# EAGLE design Motorcontroller (EAGLE 6.1)
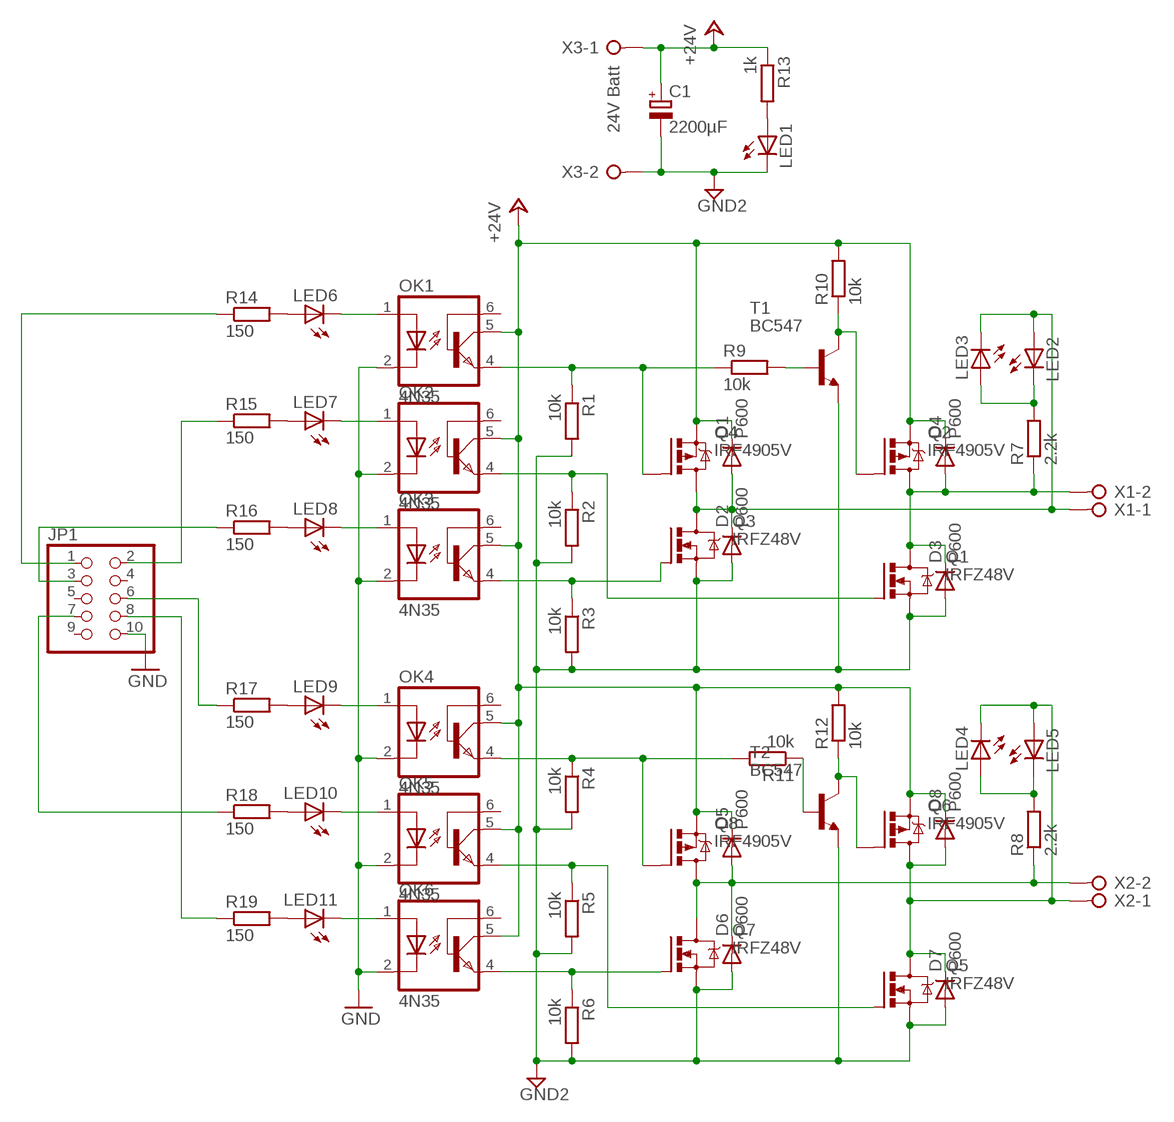
[diagram p0: schematic, sheet 1]

## Parts
C1  2200µF  CPOL-EUE5-13  [E5-13]
D1  P600  [P6-15]
D2  P600  [P6-15]
D3  P600  [P6-15]
D4  P600  [P6-15]
D5  P600  [P6-15]
D6  P600  [P6-15]
D7  P600  [P6-15]
D8  P600  [P6-15]
JP1  PINHD-2X5  [2X05]
LED1  LED3MM  [LED3MM]
LED2  LED3MM  [LED3MM]
LED3  LED3MM  [LED3MM]
LED4  LED3MM  [LED3MM]
LED5  LED3MM  [LED3MM]
LED6  LED3MM  [LED3MM]
LED7  LED3MM  [LED3MM]
LED8  LED3MM  [LED3MM]
LED9  LED3MM  [LED3MM]
LED10  LED3MM  [LED3MM]
LED11  LED3MM  [LED3MM]
OK1  4N35  [DIL06]
OK2  4N35  [DIL06]
OK3  4N35  [DIL06]
OK4  4N35  [DIL06]
OK5  4N35  [DIL06]
OK6  4N35  [DIL06]
Q1  IRFZ48V  [TO220BV]
Q2  IRF4905V  [TO220BV]
Q3  IRFZ48V  [TO220BV]
Q4  IRF4905V  [TO220BV]
Q5  IRFZ48V  [TO220BV]
Q6  IRF4905V  [TO220BV]
Q7  IRFZ48V  [TO220BV]
Q8  IRF4905V  [TO220BV]
R1  10k  R-EU_0207/7  [0207/7]
R2  10k  R-EU_0207/7  [0207/7]
R3  10k  R-EU_0207/10  [0207/10]
R4  10k  R-EU_0207/10  [0207/10]
R5  10k  R-EU_0207/10  [0207/10]
R6  10k  R-EU_0207/10  [0207/10]
R7  2.2k  R-EU_0207/2V  [0207/2V]
R8  2.2k  R-EU_0207/2V  [0207/2V]
R9  10k  R-EU_0207/7  [0207/7]
R10  10k  R-EU_0207/7  [0207/7]
R11  10k  R-EU_0207/10  [0207/10]
R12  10k  R-EU_0207/10  [0207/10]
R13  1k  R-EU_0207/2V  [0207/2V]
R14  150  R-EU_0207/7  [0207/7]
R15  150  R-EU_0207/5V  [0207/5V]
R16  150  R-EU_0207/5V  [0207/5V]
R17  150  R-EU_0207/5V  [0207/5V]
R18  150  R-EU_0207/5V  [0207/5V]
R19  150  R-EU_0207/7  [0207/7]
T1  BC547  [TO92]
T2  BC547  [TO92]
X1  W237-02P  [W237-132]
X2  W237-02P  [W237-132]
X3  24V Batt  W237-02P  [W237-132]

## Nets
+24V: C1.+ D1.C D4.C D5.C D8.C OK1.5(COL) OK2.5(COL) OK3.5(COL) OK4.5(COL) OK5.5(COL) OK6.5(COL) Q2.S Q4.S Q6.S Q8.S R10.2 R12.2 R13.1 X3.1
GND: JP1.10 OK1.2(C) OK2.2(C) OK3.2(C) OK4.2(C) OK5.2(C) OK6.2(C)
GND2: C1.- D2.A D3.A D6.A D7.A LED1.K(C) Q1.S Q3.S Q5.S Q7.S R1.2 R2.2 R3.2 R4.2 R5.2 R6.2 T1.1(E) T2.1(E) X3.2
N$1: D7.C D8.A LED4.K(C) LED5.A Q5.D Q6.D X2.1
N$3: JP1.1 R14.1
N$4: D3.C D4.A Q1.D Q2.D R7.1 X1.2
N$5: JP1.2 R15.1
N$6: LED1.A R13.2
N$7: JP1.3 R16.1
N$8: JP1.6 R17.1
N$9: OK2.4(EMI) Q1.G R2.1
N$10: JP1.7 R18.1
N$11: JP1.8 R19.1
N$12: OK1.4(EMI) Q4.G R1.1 R9.1
N$13: OK3.4(EMI) Q3.G R3.1
N$14: R9.2 T1.2(B)
N$15: Q2.G R10.1 T1.3(C)
N$16: OK4.4(EMI) Q8.G R4.1 R11.2
N$17: LED10.A R18.2
N$18: R11.1 T2.2(B)
N$19: Q6.G R12.1 T2.3(C)
N$20: LED6.A R14.2
N$21: OK5.4(EMI) Q5.G R5.1
N$22: OK6.4(EMI) Q7.G R6.1
N$23: LED2.K(C) LED3.A R7.2
N$24: LED4.A LED5.K(C) R8.2
N$26: LED7.A R15.2
N$27: LED8.A R16.2
N$28: LED9.A R17.2
N$29: LED11.A R19.2
N$30: LED6.K(C) OK1.1(A)
N$31: LED7.K(C) OK2.1(A)
N$32: LED8.K(C) OK3.1(A)
N$33: LED9.K(C) OK4.1(A)
N$34: LED10.K(C) OK5.1(A)
N$35: LED11.K(C) OK6.1(A)
N$36: D1.A D2.C LED2.A LED3.K(C) Q3.D Q4.D X1.1
N$43: D5.A D6.C Q7.D Q8.D R8.1 X2.2
Unconnected: JP1.4 JP1.5 JP1.9 OK1.6(BAS) OK2.6(BAS) OK3.6(BAS) OK4.6(BAS) OK5.6(BAS) OK6.6(BAS)

## Library data of the parts
C1 = rcl:CPOL-EU: POLARIZED CAPACITOR, European symbol
D1-D8 = diode:P600: DIODE high voltage diode, silicon rectifier 1.0 A to 6.0 A, 50 V to 1300 V http://www.kosemi.com/product/diosr.html
JP1 = pinhead:PINHD-2X5: PIN HEADER
LED1-LED11 = led:LED: LED OSRAM: - CHIPLED LG R971, LG N971, LY N971, LG Q971, LY Q971, LO R971, LY R971 LH N974, LH R974 LS Q976, LO Q976, LY Q976 LO Q996 - Hyper CHIPLED LW Q18S LB Q993, LB Q99A, LB R99A - SideLED LS A670, LO A670, LY A670, LG A670, LP A670 LB A673, LV A673, LT A673, LW A673 LH A674 LY A675 LS A676, LA A676, LO A676, LY A676, LW A676 LS A679, LY A679, LG A679 - Hyper Micro SIDELED® LS Y876, LA Y876, LO Y876, LY Y876 LT Y87S - SmartLED LW L88C, LW L88S LB L89C, LB L89S, LG L890 LS L89K, LO L89K, LY L89K LS L896, LA L896, LO L896, LY L896 - TOPLED LS T670, LO T670, LY T670, LG T670, LP T670 LSG T670, LSP T670, LSY T670, LOP T670, LYG T670 LG T671, LOG T671, LSG T671 LB T673, LV T673, LT T673, LW T673 LH T674 LS T676, LA T676, LO T676, LY T676, LB T676, LH T676, LSB T676, LW T676 LB T67C, LV T67C, LT T67C, LS T67K, LO T67K, LY T67K, LW E67C LS E67B, LA E67B, LO E67B, LY E67B, LB E67C, LV E67C, LT E67C LW T67C LS T679, LY T679, LG T679 LS T770, LO T770, LY T770, LG T770, LP T770 LB T773, LV T773, LT T773, LW T773 LH T774 LS E675, LA E675, LY E675, LS T675 LS T776, LA T776, LO T776, LY T776, LB T776 LHGB T686 LT T68C, LB T68C - Hyper Mini TOPLED® LB M676 - Mini TOPLED Santana® LG M470 LS M47K, LO M47K, LY M47K Source: http://www.osram.convergy.de LUXEON: - LUMILED® LXK2-PW12-R00, LXK2-PW12-S00, LXK2-PW14-U00, LXK2-PW14-V00 LXK2-PM12-R00, LXK2-PM12-S00, LXK2-PM14-U00 LXK2-PE12-Q00, LXK2-PE12-R00, LXK2-PE12-S00, LXK2-PE14-T00, LXK2-PE14-U00 LXK2-PB12-K00, LXK2-PB12-L00, LXK2-PB12-M00, LXK2-PB14-N00, LXK2-PB14-P00, LXK2-PB14-Q00 LXK2-PR12-L00, LXK2-PR12-M00, LXK2-PR14-Q00, LXK2-PR14-R00 LXK2-PD12-Q00, LXK2-PD12-R00, LXK2-PD12-S00 LXK2-PH12-R00, LXK2-PH12-S00 LXK2-PL12-P00, LXK2-PL12-Q00, LXK2-PL12-R00 Source: www.luxeon.com KINGBRIGHT: KA-3528ASYC Source: www.kingbright.com
OK1-OK6 = optocoupler:4N35: MOTOROLA OPTO COUPLER; MF: FAIRCHILD SEMICONDUCTOR; MPN: 4N35; OC_FARNELL: 1328375; OC_NEWARK: 72K9946
Q1 Q3 Q5 Q7 = transistor-power:IRFZ48: N Channel HEXFET® Power MOSFET Logic Level Source: http://www.irf.com/product-info/datasheets/data/irfz48z.pdf
Q2 Q4 Q6 Q8 = transistor-power:IRF4905: P-Channel HEXFET® Power MOSFET RDS(on)= 0.02 Ohm, ID = -74A Source: http://www.irf.com/product-info/datasheets/data/irf4905pbf.pdf
R1-R19 = rcl:R-EU_: RESISTOR, European symbol
T1 T2 = transistor:BC547: NPN TRANSISTOR
X1-X3 = con-wago-508:W237-02P: WAGO SREW CLAMP; OC_FARNELL: unknown; OC_NEWARK: unknown

## Board
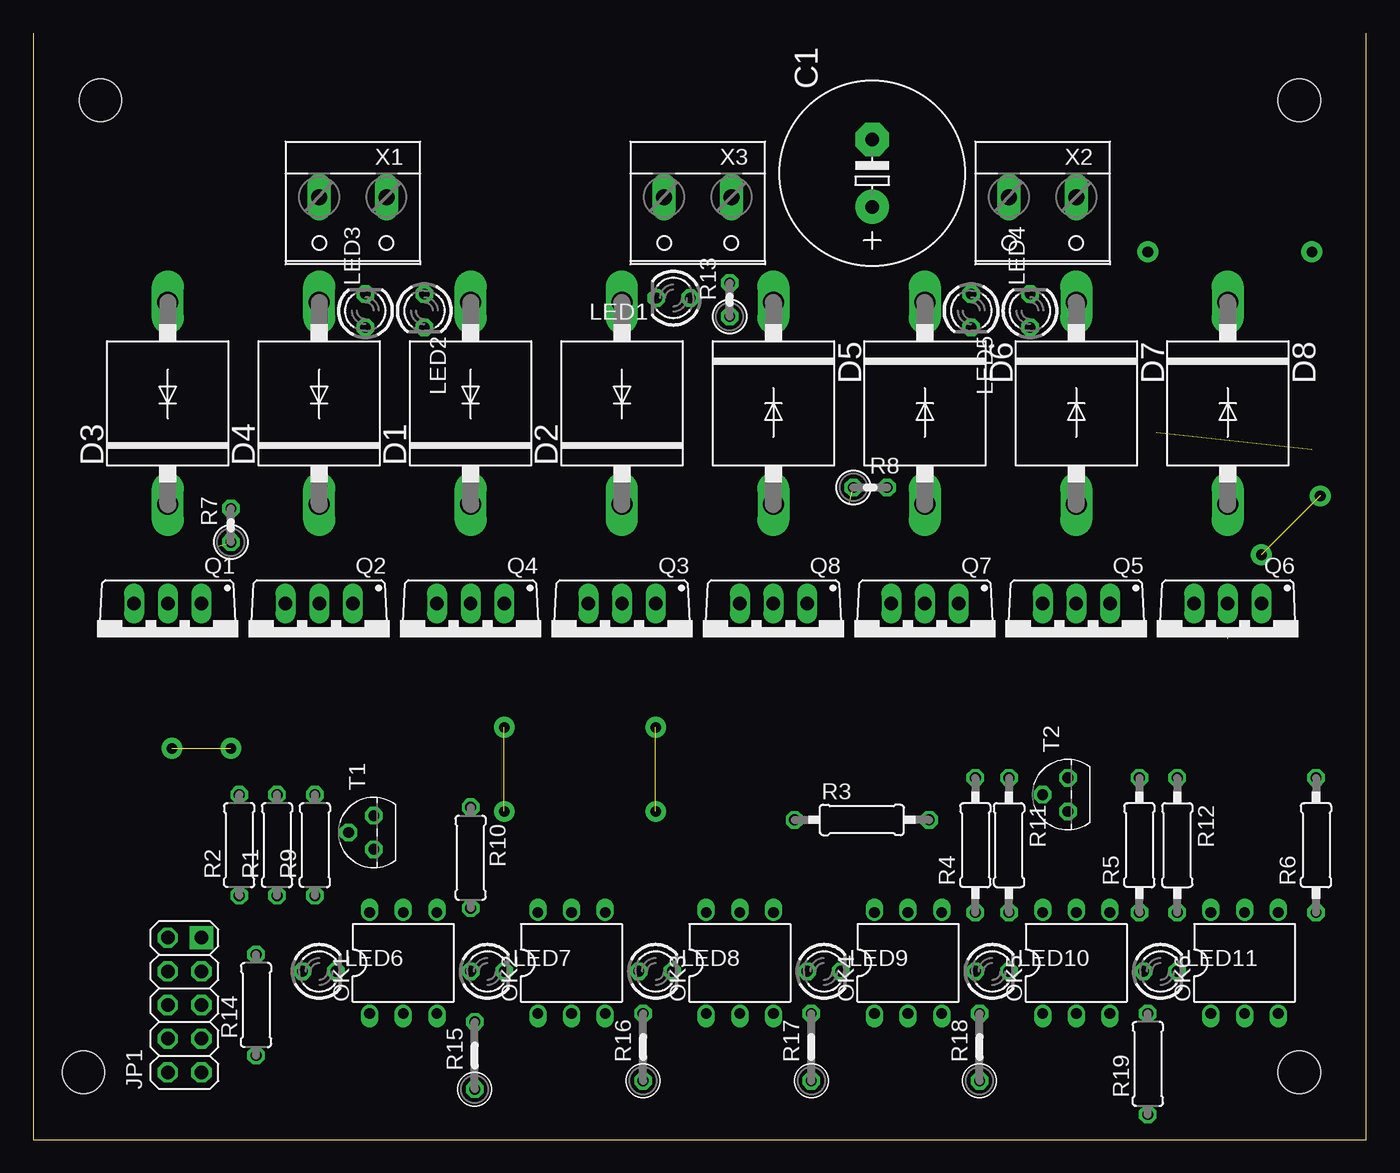
[diagram p1: board, top side]
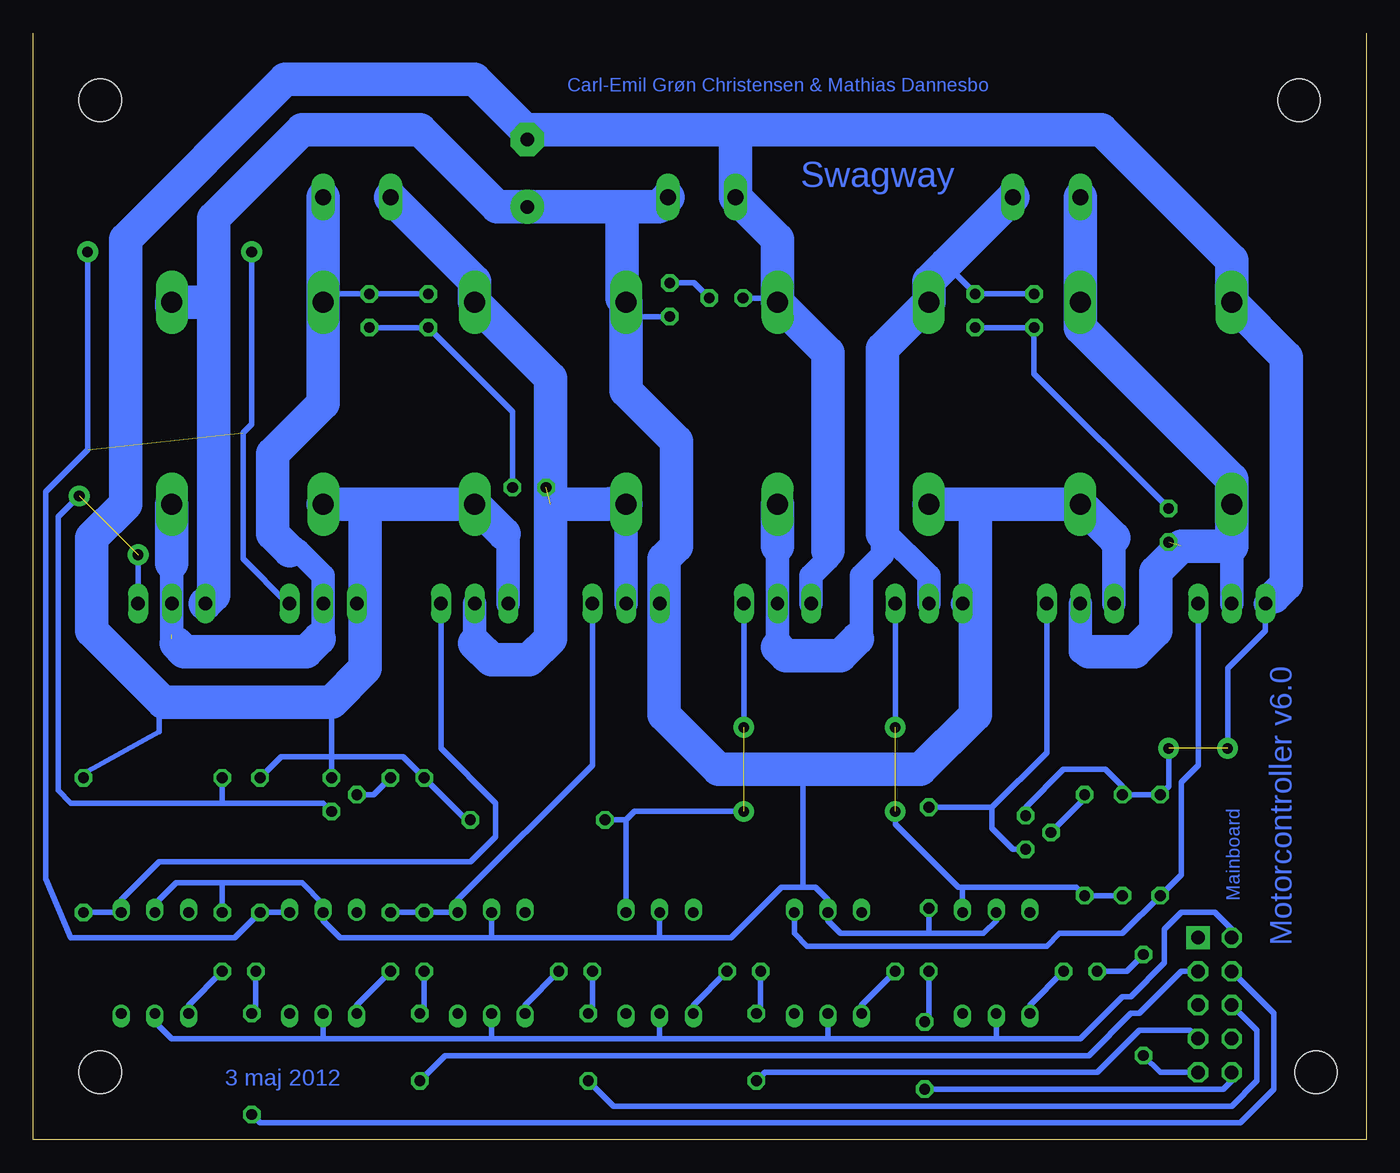
[diagram p2: board, bottom side, seen from below]

Size 100.64 x 83.49 mm. Coordinates in mm from the lower left corner, seen from the top.
Outline: 100.64,83.49 100.64,0 0,0 0,83.49
Copper layers (1*16): Top 0.035mm / dielectric 1.5mm / Bottom 0.035mm
Design rules: minimum track width 10mil, minimum drill 24mil, track to track 8mil, track to pad 8mil, pad to pad 8mil, via to via 8mil, smd to smd 8mil, copper to edge 40mil, drill to drill 8mil, minimum pad ring 10mil, minimum via ring 15mil, stop-mask expansion 4mil, vias tented up to drill 0mil, thermal gap 10mil
Holes 3.2 mm at 5.08,78.42 95.57,78.42 3.81,5.08 95.57,5.08

### Footprints (pad centres in the part's own frame; a part is rotated, then mirrored left to right if it is on the bottom)
E5-13 = drill 1.016 pad 2.54: + -2.54,0 | drill 1.016 pad 2.54 octagon: - 2.54,0
P6-15 = drill 1.6 long: A 7.62,0; C -7.62,0
2X05 = drill 1.016 octagon: 1 -5.08,-1.27; 2 -5.08,1.27; 3 -2.54,-1.27; 4 -2.54,1.27; 5 0,-1.27; 6 0,1.27; 7 2.54,-1.27; 8 2.54,1.27; 9 5.08,-1.27; 10 5.08,1.27
LED3MM = drill 0.813 octagon: A -1.27,0; K 1.27,0
DIL06 = drill 0.813 offset: 1 -2.54,-3.81; 2 0,-3.81; 3 2.54,-3.81; 4 2.54,3.81; 5 0,3.81; 6 -2.54,3.81
TO220BV = drill 1.016 long: D 0,-2.54; G -2.54,-2.54; S 2.54,-2.54
0207/7 = drill 0.813 octagon: 1 -3.81,0; 2 3.81,0
0207/10 = drill 0.813 octagon: 1 -5.08,0; 2 5.08,0
0207/2V = drill 0.813 octagon: 1 -1.27,0; 2 1.27,0
0207/5V = drill 0.813 octagon: 1 -2.54,0; 2 2.54,0
TO92 = drill 0.813 octagon: 1 1.27,0; 2 0,1.905; 3 -1.27,0
W237-132 = drill 1.194 long: 1 -2.54,-0.635; 2 2.54,-0.635

### Placement (x,y rotation side)
C1  63.34,72.93 90 top
D1  33.02,55.56 90 top
D2  44.45,55.56 90 top
D3  10.16,55.56 90 top
D4  21.59,55.56 90 top
D5  55.88,55.56 270 top
D6  67.31,55.56 270 top
D7  78.74,55.56 270 top
D8  90.17,55.56 270 top
JP1  11.43,10.16 90 top
LED1  48.32,63.5 180 top
LED2  29.53,62.55 270 top
LED3  25.08,62.55 90 top
LED4  75.25,62.55 90 top
LED5  70.8,62.55 270 top
LED6  21.59,12.7 0 top
LED7  34.29,12.7 0 top
LED8  46.99,12.7 0 top
LED9  59.69,12.7 0 top
LED10  72.39,12.7 0 top
LED11  85.09,12.7 0 top
OK1  27.94,13.34 0 top
OK2  40.64,13.34 0 top
OK3  53.34,13.34 0 top
OK4  66.04,13.34 0 top
OK5  78.74,13.34 0 top
OK6  91.44,13.34 0 top
Q1  10.16,37.91 180 top
Q2  21.59,37.91 180 top
Q3  44.45,37.91 180 top
Q4  33.02,37.91 180 top
Q5  78.74,37.91 180 top
Q6  90.17,37.91 180 top
Q7  67.31,37.91 180 top
Q8  55.88,37.91 180 top
R1  18.41,22.23 90 top
R2  15.56,22.23 90 top
R3  62.55,24.13 0 top
R4  71.12,22.23 90 top
R5  83.5,22.23 90 top
R6  96.84,22.23 90 top
R7  14.92,46.36 90 top
R8  63.18,49.21 0 top
R9  21.27,22.23 90 top
R10  33.02,21.27 270 top
R11  73.66,22.23 270 top
R12  86.36,22.23 270 top
R13  52.58,63.37 90 top
R14  16.83,10.16 90 top
R15  33.34,6.35 90 top
R16  46.04,6.98 90 top
R17  58.74,6.98 90 top
R18  71.44,6.98 90 top
R19  84.14,5.72 90 top
T1  25.72,23.18 90 top
T2  78.11,26.03 90 top
X1  24.13,70.48 180 top
X2  76.2,70.48 180 top
X3  50.16,70.48 180 top

### Tracks (layer width: path | path; a pad name or v marks a point on that pad's centre or on a via)
+24V
  Bottom 0.406: R13.1 55.75,62.1 | OK1.5 27.94,16.51 28.89,15.56 33.02,15.56 | 33.02,15.56 39.69,15.56 40.64,16.51 OK2.5 40.64,18.1 41.59,19.05 42.55,19.05 | 53.34,15.24 47.94,15.24 44.13,19.05 42.55,19.05 | 53.34,15.24 66.04,15.24 | OK3.5 53.34,15.24 | OK4.5 66.04,15.24 | 66.04,15.24 77.47,15.24 78.74,16.51 OK5.5 78.74,17.78 80.33,19.37 86.36,19.37 | 86.36,19.37 89.85,19.37 91.44,17.78 OK6.5 | R12.2 86.36,19.37 | 42.55,19.05 42.55,27.94 | R10.2 33.02,15.56
  Bottom 1.524: 55.75,62.1 55.88,62.23
  Bottom 1.778: Q2.S 19.05,45.4 | Q8.S 53.15,40.45 53.02,40.32 | Q4.S 29.65,40.45 29.53,40.32
  Bottom 2.54: D1.C 29.53,47.94 | 29.53,47.94 D4.C 19.05,45.4 | 29.53,47.94 29.53,40.32 29.53,32.07 33.66,27.94 42.55,27.94 48.9,27.94 53.02,32.07 53.02,40.32 53.02,43.81 52.07,44.77 52.07,52.7 55.88,56.52 55.88,62.23 D5.C 56.2,63.5 56.2,70.39 | Q6.S 87,41.08 87,63.18 | 87,63.18 87,69.53 80.33,76.2 71.44,76.2 65.62,70.39 C1.+ 56.2,70.39 | 90.17,62.86 D8.C 87,63.18 | X3.1 53.44,70.39 56.2,70.39
GND
  Bottom 0.406: OK1.2 27.94,7.62 | 27.94,7.62 40.64,7.62 | 40.64,7.62 53.34,7.62 | 53.34,7.62 66.04,7.62 | 66.04,7.62 78.74,7.62 | 78.74,7.62 90.17,7.62 91.44,8.89 OK6.2 | OK5.2 78.74,7.62 | OK4.2 66.04,7.62 | OK3.2 53.34,7.62 | OK2.2 40.64,7.62 | JP1.10 10.16,15.88 11.43,17.15 13.97,17.15 15.24,15.88 15.24,13.34 17.78,10.8 18.41,10.8 21.59,7.62 27.94,7.62
GND2  (1 unrouted)
  Bottom 0.406: LED1.K 44.77,63.5 D2.A | T1.1 25.72,25.08 22.86,27.94 19.68,27.94 18.41,26.67 R1.2 R2.2 14.92,26.67 14.92,29.53 | R6.2 96.84,27.62 91.12,30.8 91.12,32.7 90.81,33.02 | Q1.S 7.62,38.42 10.48,35.56 10.48,29.53 | R3.2 67.94,24.13 R4.2 72.71,28.89 78.11,28.89 | 78.11,28.89 81.92,28.89 R5.2 | T2.1 78.11,28.89 | 78.11,28.89 78.11,33.02 | Q5.S 75.69,40.45 75.56,40.32
  Bottom 1.778: Q1.S 7.49,40.45 6.99,40.96 | Q7.S 64.77,45.4 65.09,45.72 | Q3.S 41.91,42.55 40.64,43.81 40.64,44.45
  Bottom 2.54: 6.99,40.96 6.03,41.91 6.03,59.06 D3.A 10.16,66.36 20,76.2 47.62,76.2 | 75.56,47.94 D6.A 65.09,45.72 | 75.56,47.94 D7.A | 47.62,76.2 X3.2 44.45,67.94 D2.A 40.64,59.37 40.64,44.45 | 47.62,76.2 63.5,76.2 | 75.56,47.94 75.56,40.32 75.56,35.56 78.11,33.02 90.81,33.02 96.2,38.42 96.2,45.4 93.66,47.94 93.66,67.94 81.6,80.01 67.31,80.01 63.5,76.2 | 63.5,76.2 63.34,76.04 C1.-
N$1  (1 unrouted)
  Bottom 0.406: LED5.A LED4.K 78.74,63.82
  Bottom 1.778: 81.28,44.45 80.64,44.45 78.74,42.55 Q5.D 78.74,38.1 79.06,37.78 | 90.17,43.5 Q6.D 90.17,38.1 | 90.17,37.78 89.85,37.47
  Bottom 2.54: 90.17,43.5 D8.A | 81.28,44.45 82.55,45.72 82.55,51.75 78.74,55.56 D7.C 78.74,63.82 X2.1 | 89.85,37.47 89.22,36.83 80.01,36.83 79.06,37.78
N$2  (via drill 0.8)
  other vias: 10.48,29.53
N$3
  Bottom 0.406: JP1.1 15.56,5.08 R14.1
N$4  (1 unrouted)
  Bottom 1.778: Q2.D 21.59,36.83 20.95,36.83 | Q1.D 10.16,44.77
  Bottom 2.54: 20.95,36.83 17.46,36.83 15.88,38.42 15.88,42.86 13.97,44.77 10.16,44.77 D3.C 10.16,49.85 21.59,61.28 D4.A X1.2
N$5
  Bottom 0.406: R15.1 10.79,3.81 10.16,4.45 JP1.2
N$6
  Bottom 0.406: R13.2 50.74,64.64 LED1.A
N$7
  Bottom 0.406: JP1.3 13.34,8.26 17.14,8.26 20.32,5.08 45.4,5.08 R16.1
N$8
  Bottom 0.406: R17.1 56.83,2.54 10.16,2.54 8.26,4.45 8.26,8.26 JP1.6
N$9
  Bottom 0.406: OK2.4 43.18,15.56 42.23,14.6 24.13,14.6 23.18,15.56 18.41,15.56 R2.1 13.97,20 13.97,26.99 12.7,28.26 Q1.G
N$10
  Bottom 0.406: R18.1 69.53,6.35 20.95,6.35 17.78,9.52 17.14,9.52 13.97,12.7 JP1.7
N$11
  Bottom 0.406: JP1.8 6.99,9.52 6.99,3.81 9.53,1.27 83.5,1.27 R19.1
N$12  (via drill 0.8)  (1 unrouted)
  Bottom 0.406: Q4.G v35.56,31.12 | R1.1 R9.1 21.91,19.05 30.48,19.05 | OK1.4 30.48,19.05 | 35.56,24.77 35.56,23.81 30.8,19.05 30.48,19.05
N$13  (via drill 0.8, 0.8 pad 0.41)  (1 unrouted)
  Bottom 0.406: Q3.G v46.99,31.12 | OK3.4 55.88,24.13 | 55.88,24.13 R3.1 | v46.99,24.77 55.24,24.77 55.88,24.13
N$14
  Bottom 0.406: R9.2 21.27,25.72 T1.2
N$15
  Bottom 0.406: R10.1 28.26,25.08 | 28.26,25.08 28.26,23.49 26.67,21.91 T1.3 | Q2.G 24.13,29.21 28.26,25.08
N$16
  Bottom 0.406: R11.2 R4.1 OK4.4 68.58,18.1 58.42,28.26 Q8.G
N$17
  Bottom 0.406: LED10.A 71.12,9.84 R18.2
N$18
  Bottom 0.406: T2.2 74.93,26.03 R11.1
N$19  (via drill 0.8)  (1 unrouted)
  Bottom 0.406: Q6.G v92.71,44.13 | 86.36,25.4 97.79,25.4 98.74,26.35 98.74,46.99 v97.16,48.58 | 86.36,25.4 78.74,25.4 T2.3 | R12.1 86.36,25.4
N$20
  Bottom 0.406: LED6.A 18.1,12.7 R14.2
N$21  (via drill 0.8)  (1 unrouted)
  Bottom 0.406: OK5.4 R5.1 85.41,15.24 97.79,15.24 99.69,19.69 99.69,48.89 96.52,52.07 v96.52,66.99 | Q5.G 81.41,40.45 84.77,43.81 84.77,53.34 84.14,53.97 v84.14,66.99
N$22
  Bottom 0.406: R6.1 OK6.4 93.98,18.1 91.44,20.64 91.12,20.95 67.63,20.95 65.72,22.86 65.72,25.4 69.85,29.53 Q7.G
N$23
  Bottom 0.406: LED2.K LED3.A 25.08,57.78 R7.2
N$24
  Bottom 0.406: LED4.A LED5.K 64.45,54.93 R8.2
N$26
  Bottom 0.406: LED7.A 33.02,9.21 R15.2
N$27
  Bottom 0.406: LED8.A 45.72,9.84 R16.2
N$28
  Bottom 0.406: LED9.A 58.42,9.84 R17.2
N$29
  Bottom 0.406: LED11.A 83.82,9.84 R19.2
N$30
  Bottom 0.406: OK1.1 25.4,10.16 LED6.K
N$31
  Bottom 0.406: OK2.1 38.1,10.16 LED7.K
N$32
  Bottom 0.406: OK3.1 50.8,10.16 LED8.K
N$33
  Bottom 0.406: OK4.1 63.5,10.16 LED9.K
N$34
  Bottom 0.406: OK5.1 76.2,10.16 LED10.K
N$35
  Bottom 0.406: OK6.1 88.9,10.16 LED11.K
N$36
  Bottom 0.406: LED3.K LED2.A 31.75,66.04
  Bottom 1.778: Q4.D 33.02,42.55 36.51,46.04 | 44.45,44.77 Q3.D 44.45,37.15 | 38.42,37.78 38.1,38.1 38.1,42.55 36.51,44.13 36.51,45.72
  Bottom 2.54: D2.C 44.45,44.77 | X1.1 31.75,66.04 33.02,64.77 D1.A 36.51,59.69 36.51,46.04 36.51,45.72 | 38.42,37.78 39.69,36.51 43.81,36.51 44.45,37.15
N$37  (via drill 0.8)
  other vias: 14.92,29.53
N$38  (via drill 1)
  other vias: 12.7,15.24
N$39  (via drill 0.8)
  other vias: 35.56,24.77
N$43  (1 unrouted)
  Bottom 1.778: Q7.D 67.31,37.47 | Q8.D D5.A
  Bottom 2.54: 61.59,47.94 61.59,57.47 D6.C 67.31,64.77 X2.2 | 61.59,47.94 D5.A | 61.59,47.94 61.59,37.78 63.18,36.19 66.04,36.19 67.31,37.47

### Text on the board
Bottom: Carl-Emil Grøn Christensen & Mathias Dannesbo | Swagway | + | Motorcontroller v6.0 | Mainboard | 3 maj 2012